# EAGLE schematic midi-in-out (EAGLE 7.7.0)
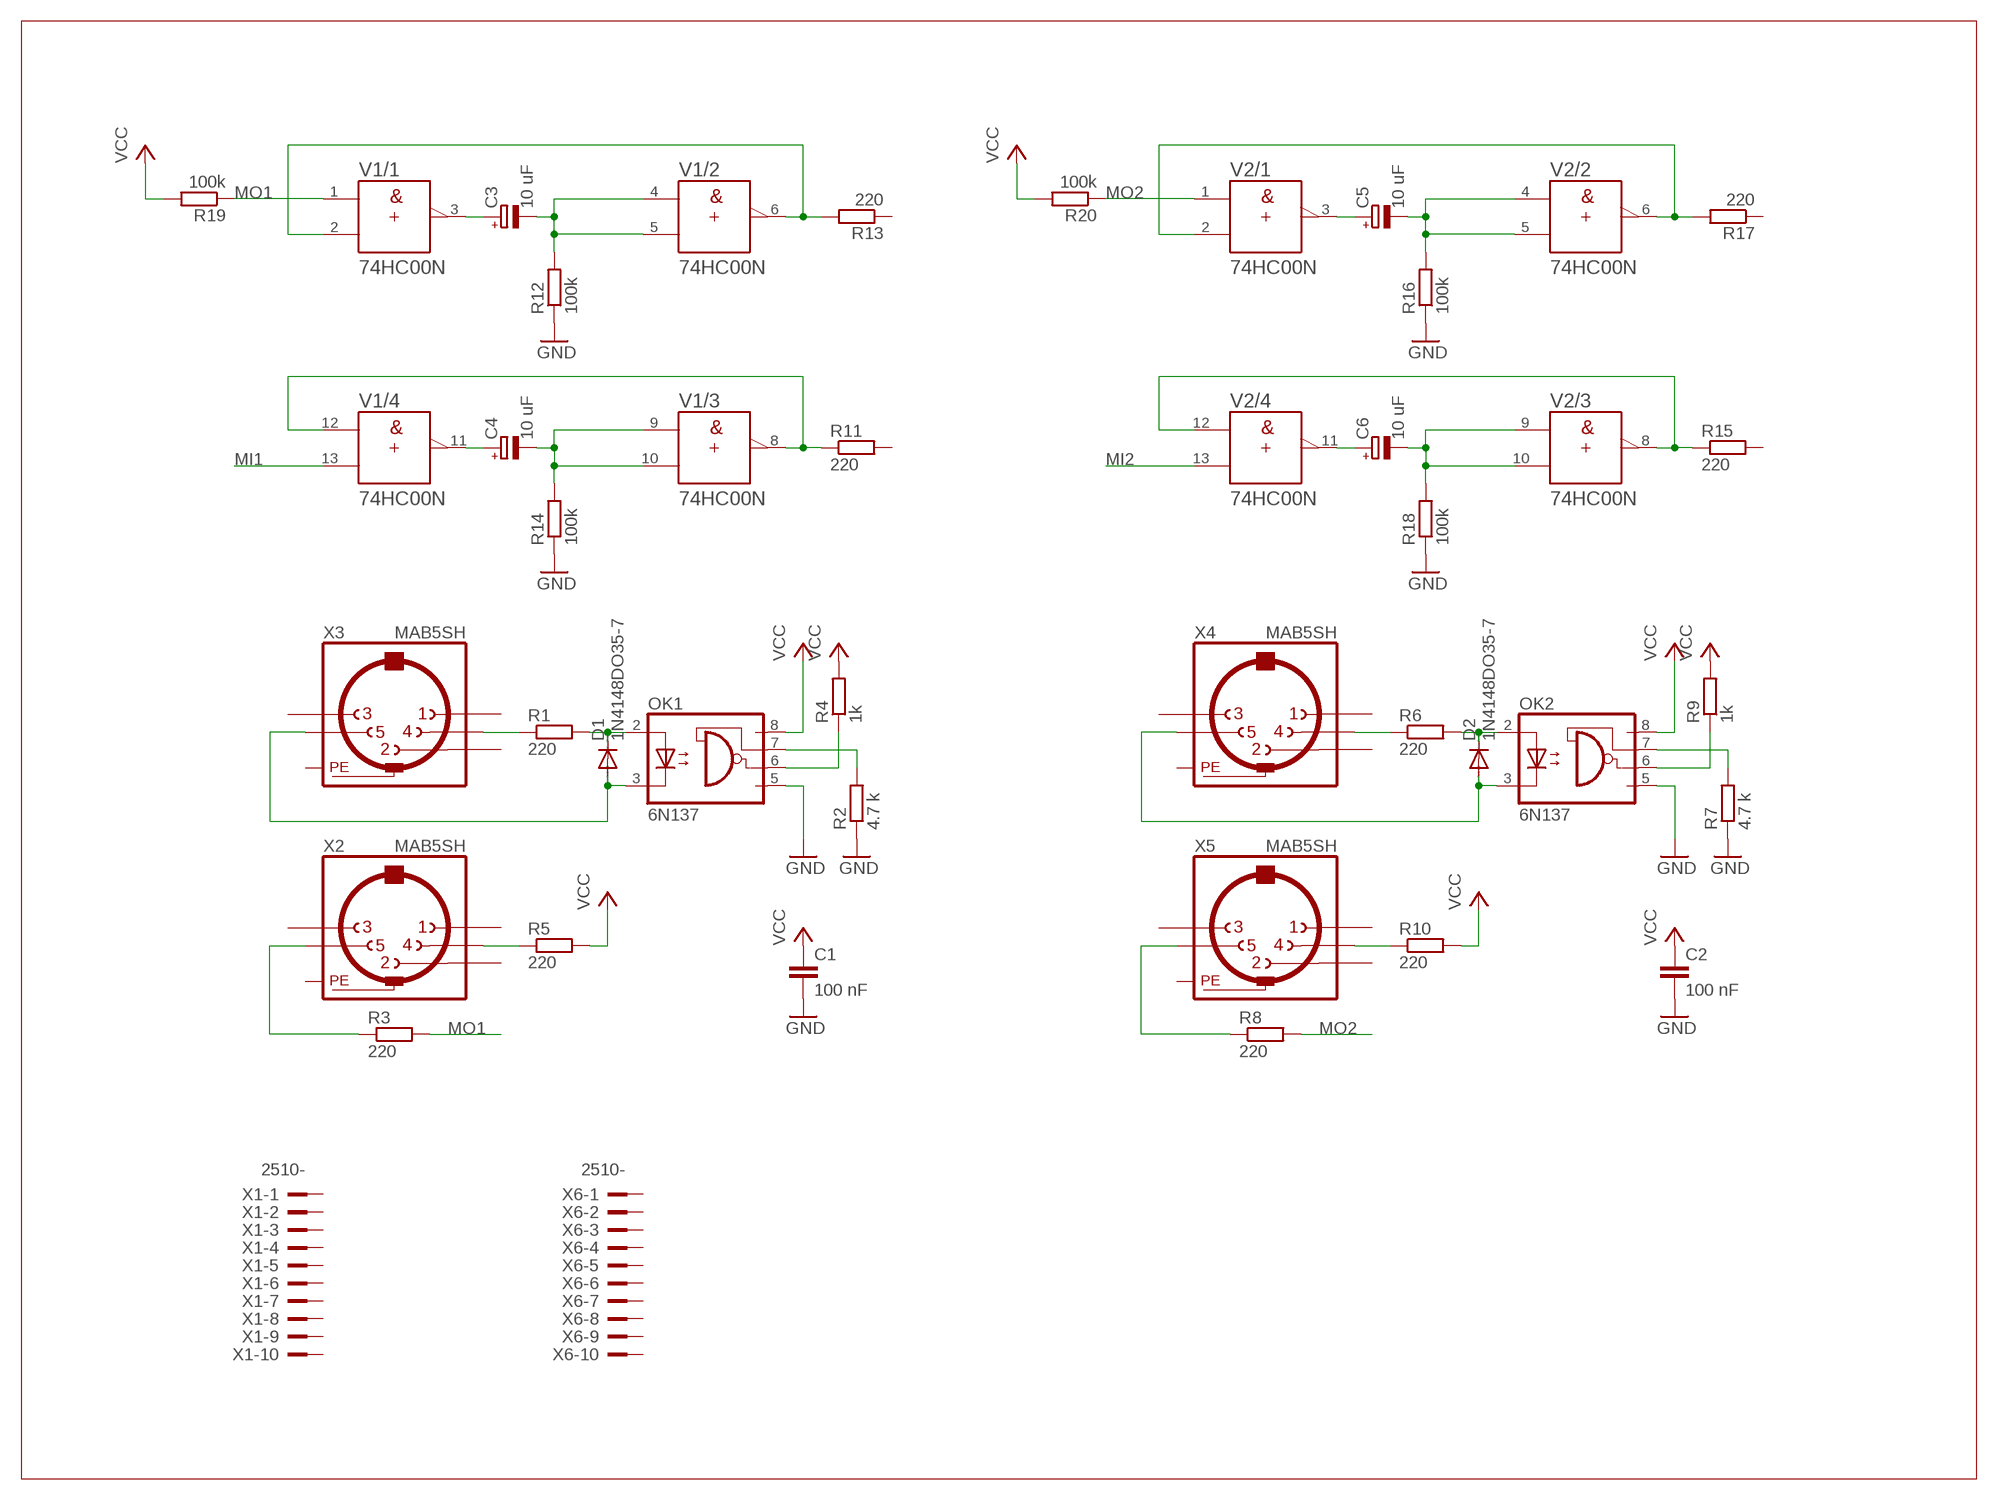
[diagram p0: schematic, sheet 1]

## Parts
C1  100 nF  C-EU025-024X044  [C025-024X044]
C2  100 nF  C-EU025-024X044  [C025-024X044]
C3  10 uF  CPOL-EUE2.5-5  [E2,5-5]
C4  10 uF  CPOL-EUE2.5-5  [E2,5-5]
C5  10 uF  CPOL-EUE2.5-5  [E2,5-5]
C6  10 uF  CPOL-EUE2.5-5  [E2,5-5]
D1  1N4148DO35-7  [DO35-7]
D2  1N4148DO35-7  [DO35-7]
OK1  6N137  [DIL08]
OK2  6N137  [DIL08]
R1  220  R-EU_0204/7  [0204/7]
R2  4.7 k  R-EU_0204/7  [0204/7]
R3  220  R-EU_0204/7  [0204/7]
R4  1k  R-EU_0204/7  [0204/7]
R5  220  R-EU_0204/7  [0204/7]
R6  220  R-EU_0204/7  [0204/7]
R7  4.7 k  R-EU_0204/7  [0204/7]
R8  220  R-EU_0204/7  [0204/7]
R9  1k  R-EU_0204/7  [0204/7]
R10  220  R-EU_0204/7  [0204/7]
R11  220  R-EU_0204/7  [0204/7]
R12  100k  R-EU_0204/7  [0204/7]
R13  220  R-EU_0204/7  [0204/7]
R14  100k  R-EU_0204/7  [0204/7]
R15  220  R-EU_0204/7  [0204/7]
R16  100k  R-EU_0204/7  [0204/7]
R17  220  R-EU_0204/7  [0204/7]
R18  100k  R-EU_0204/7  [0204/7]
R19  100k  R-EU_0204/7  [0204/7]
R20  100k  R-EU_0204/7  [0204/7]
V1  74HC00N  [DIL14]
V2  74HC00N  [DIL14]
X1  2510-  [PAK100/2500-10]
X2  MAB5SH  [MAB5SH]
X3  MAB5SH  [MAB5SH]
X4  MAB5SH  [MAB5SH]
X5  MAB5SH  [MAB5SH]
X6  2510-  [PAK100/2500-10]

## Nets
GND: C1.2 C2.2 OK1.5(GND) OK2.5(GND) R2.1 R7.1 R12.1 R14.1 R16.1 R18.1
MI1: V1.13(/4:B)
MI2: V2.13(/4:B)
MO1: R3.2 R19.1 V1.1(/1:A)
MO2: R8.2 R20.1 V2.1(/1:A)
N$1: D1.C OK1.2(A) R1.2
N$2: D1.A OK1.3(C) X3.5
N$3: OK1.7(VE) R2.2
N$4: R1.1 X3.4
N$5: OK1.6(VO) R4.1
N$6: R3.1 X2.5
N$7: R5.1 X2.4
N$8: D2.C OK2.2(A) R6.2
N$9: D2.A OK2.3(C) X4.5
N$10: OK2.7(VE) R7.2
N$11: R6.1 X4.4
N$12: R8.1 X5.5
N$13: OK2.6(VO) R9.1
N$14: R10.1 X5.4
N$15: C4.+ V1.11(/4:Y)
N$16: C3.- R12.2 V1.4(/2:A) V1.5(/2:B)
N$17: C3.+ V1.3(/1:Y)
N$18: R13.2 V1.2(/1:B) V1.6(/2:Y)
N$19: C4.- R14.2 V1.9(/3:A) V1.10(/3:B)
N$20: R11.1 V1.8(/3:Y) V1.12(/4:A)
N$21: C5.- R16.2 V2.4(/2:A) V2.5(/2:B)
N$22: C5.+ V2.3(/1:Y)
N$23: R17.2 V2.2(/1:B) V2.6(/2:Y)
N$24: C6.+ V2.11(/4:Y)
N$25: C6.- R18.2 V2.9(/3:A) V2.10(/3:B)
N$26: R15.1 V2.8(/3:Y) V2.12(/4:A)
VCC: C1.1 C2.1 OK1.8(VCC) OK2.8(VCC) R4.2 R5.2 R9.2 R10.2 R19.2 R20.2
Unconnected: R11.2 R13.1 R15.2 R17.1 X1.1 X1.2 X1.3 X1.4 X1.5 X1.6 X1.7 X1.8 X1.9 X1.10 X2.1 X2.2 X2.3 X3.1 X3.2 X3.3 X4.1 X4.2 X4.3 X5.1 X5.2 X5.3 X6.1 X6.2 X6.3 X6.4 X6.5 X6.6 X6.7 X6.8 X6.9 X6.10

## Power pins joined to a net without a drawn wire
+UB: V1.14(/+UB:+UB) V2.14(/+UB:+UB)
-UB: V1.7(/-UB:-UB) V2.7(/-UB:-UB)
PE: X2.PE X2.PE@(PE) X3.PE X3.PE@(PE) X4.PE X4.PE@(PE) X5.PE X5.PE@(PE)

## Library data of the parts
C1 C2 = rcl:C-EU: CAPACITOR, European symbol
C3-C6 = rcl:CPOL-EU: POLARIZED CAPACITOR, European symbol
D1 D2 = diode:1N4148: DIODE high speed (Philips)
OK1 OK2 = optocoupler:6N137: MOTOROLA OPTO COUPLER; MPN: 6N137; OC_FARNELL: 1328376; OC_NEWARK: 52M1895
R1-R20 = rcl:R-EU_: RESISTOR, European symbol
V1 V2 = 74ttl-din:74*00: Quad 2-input NAND gate
X1 X6 = con-3m:2510-: 3M (TM) Pak 100 4-Wall Header Source: 3M; MF: 3M; MPN: 2510-6002UB; OC_FARNELL: 9838244; OC_NEWARK: 46F4725
X2-X5 = con-hirschmann:MAB5SH: Female CONNECTOR 5 pins 90 deg. with shield, horizontal (DIN 41524); OC_FARNELL: 809883; OC_NEWARK: unknown